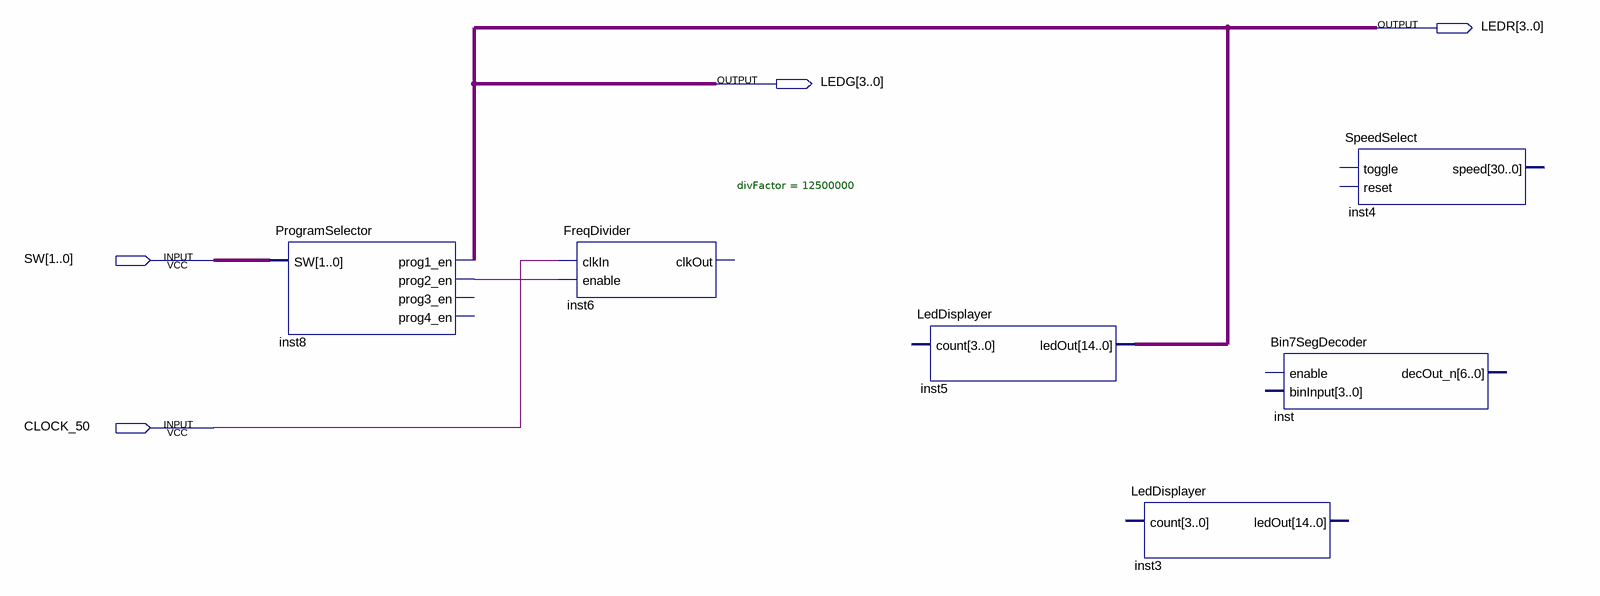
[diagram p0: schematic sheet]
// Quartus schematic projeto.bdf as structural Verilog: 6 symbols, 4 pins
module projeto (
  input  [1:0] SW,
  input  CLOCK_50,
  output [3:0] LEDR,
  output [3:0] LEDG
);

  wire inst8_prog2_en;

  ProgramSelector inst8 (.SW(SW), .prog1_en(LEDG), .prog2_en(inst8_prog2_en));  // open: prog3_en, prog4_en
  FreqDivider #(.divFactor(12500000)) inst6 (.clkIn(CLOCK_50), .enable(inst8_prog2_en));  // open: clkOut
  LedDisplayer inst5 (.ledOut(LEDG));  // open: count
  LedDisplayer inst3 ();  // open: count, ledOut
  Bin7SegDecoder inst ();  // open: enable, binInput, decOut_n
  SpeedSelect inst4 ();  // open: toggle, reset, speed

  assign LEDR = LEDG;
endmodule
